# Altium project Dionysus_Camera_Expansion.PrjPCB
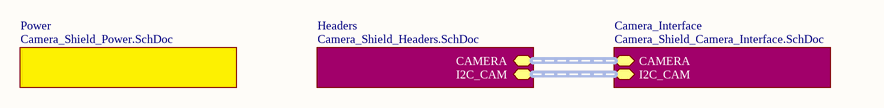
[diagram p0: Camera_Shield_Main.SchDoc]
revision: D
4 sheets, 30 parts. Net scope: hierarchical (ports join the sheet entries above them; power ports are global).
Board file: CAMERA_SHEILD_PCB.PcbDoc
Sheets:
  Camera_Shield_Main.SchDoc
    Camera_Interface = Camera_Shield_Camera_Interface.SchDoc
    Headers = Camera_Shield_Headers.SchDoc
    Power = Camera_Shield_Power.SchDoc

## Sheet Camera_Shield_Main.SchDoc: Block Diagram
size B; CompanyName: Cospan Design; DrawnBy: David McCoy; Engineer: David McCoy; Organization: Cospan Design; DocumentNumber: 1; Revision: .revision; SheetNumber: 1; SheetTotal: 4

### Sub-sheets
Camera_Interface = Camera_Shield_Camera_Interface.SchDoc: I2C_CAM (harness I2C_Harness), CAMERA (harness CAM_Harness)
Headers = Camera_Shield_Headers.SchDoc: I2C_CAM (harness I2C_Harness), CAMERA (harness CAM_Harness)
Power = Camera_Shield_Power.SchDoc: no entries

### Buses and harness runs
harness sheet Camera_Interface/CAMERA = sheet Headers/CAMERA
harness sheet Camera_Interface/I2C_CAM = sheet Headers/I2C_CAM

### Notes on the sheet
- Title:
- http://www.cospandesign.com
- Cospan Design
- Project:
- Document:
- Engineer:
- Drawn By:
- Approved By:
- Revision:
- Date:
- Number:
- of

## Sheet Camera_Shield_Camera_Interface.SchDoc: Camera Interface
size B; CompanyName: Cospan Design; DrawnBy: David McCoy; Engineer: David McCoy; Organization: Cospan Design; DocumentNumber: 3; Revision: .revision; SheetNumber: 3; SheetTotal: 4
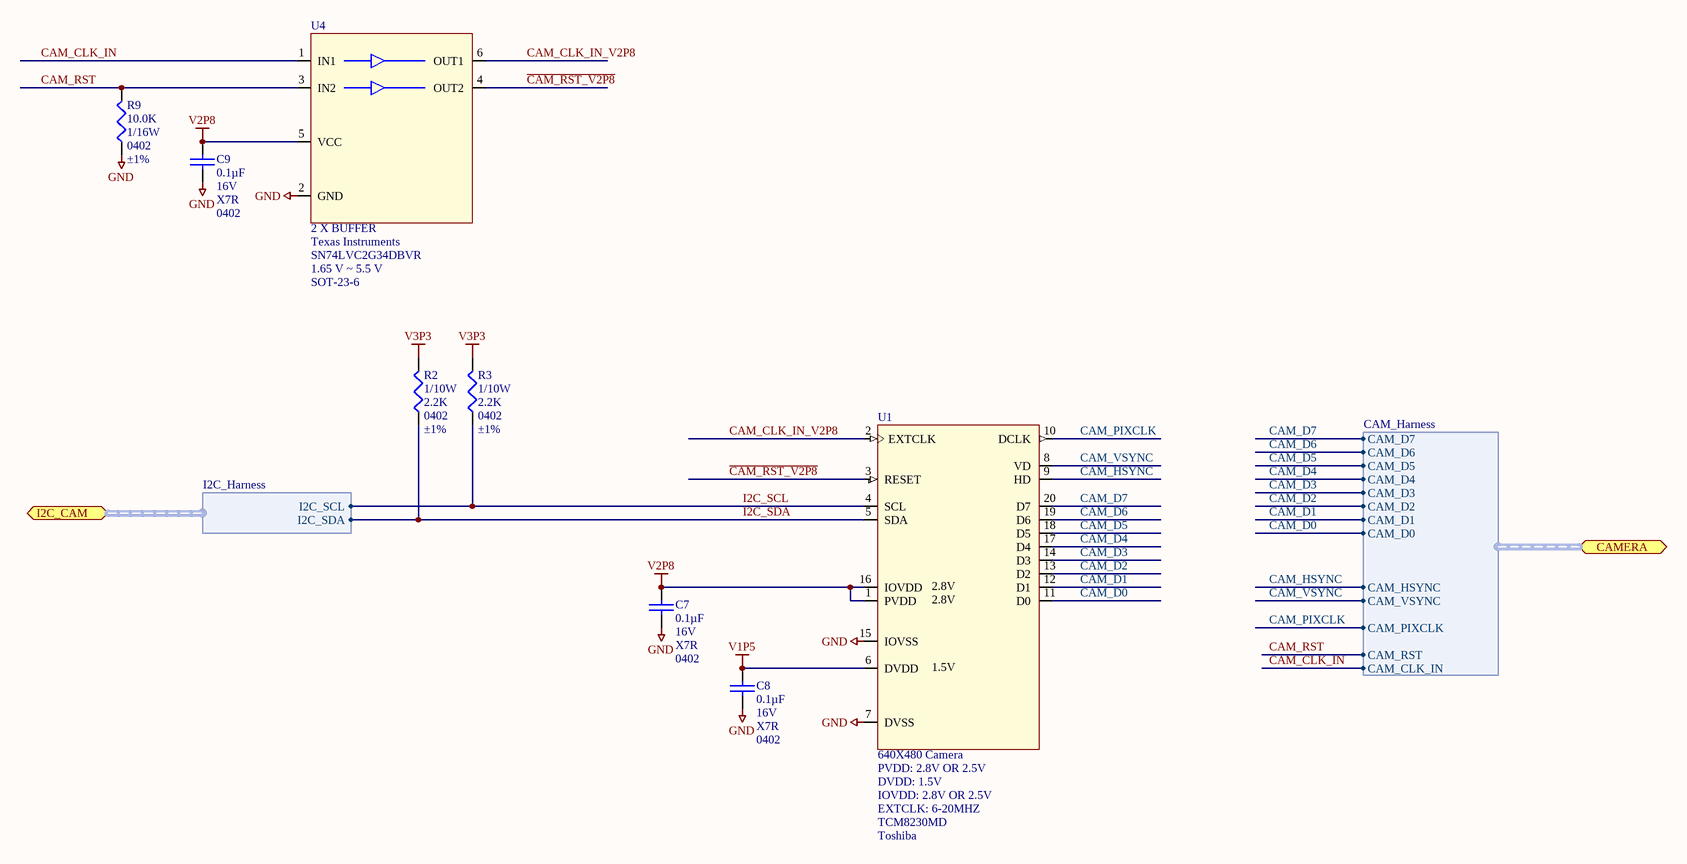
[diagram p1: Camera_Shield_Camera_Interface.SchDoc]

### Parts
C7  Capacitance: 0.1µF  Voltage - Rated: 16V  Temperature Coefficient: X7R  Package / Case: 0402  [C_0402]  (hidden comment: 0.1uF)
C8  Capacitance: 0.1µF  Voltage - Rated: 16V  Temperature Coefficient: X7R  Package / Case: 0402  [C_0402]  (hidden comment: 0.1uF)
C9  Capacitance: 0.1µF  Voltage - Rated: 16V  Temperature Coefficient: X7R  Package / Case: 0402  [C_0402]  (hidden comment: 0.1uF)
R2  Power (Watts): 1/10W  Resistance In Ohms: 2.2K  Case: 0402  Tolerance: ±1%  [ERA-0402]  (hidden comment: 2.2k Ohms)
R3  Power (Watts): 1/10W  Resistance In Ohms: 2.2K  Case: 0402  Tolerance: ±1%  [ERA-0402]  (hidden comment: 2.2k Ohms)
R9  Resistance In Ohms: 10.0K  Power (Watts): 1/16W  Case: 0402  Tolerance: ±1%  [R_0402]  (hidden comment: R_0402_10.0K)
U1  640X480 Camera  PVDD: 2.8V OR 2.5V  DVDD: 1.5V  EXTCLK: 6-20MHZ  Manufacturer: Toshiba  [TCM8230MD]
U4  2 X BUFFER  Manufacturer: Texas Instruments  Manufacturer Part Number: SN74LVC2G34DBVR  Voltage - Supply: 1.65 V ~ 5.5 V  Supplier Device Package: SOT-23-6  [SOT23-6]

### Ports
CAMERA (harness CAM_Harness), I2C_CAM (harness I2C_Harness)

### Harnesses
I2C_Harness: I2C_SDA, I2C_SCL
CAM_Harness: CAM_D7, CAM_D6, CAM_D5, CAM_D4, CAM_D3, CAM_D2, CAM_D1, CAM_D0, CAM_HSYNC, CAM_VSYNC, CAM_PIXCLK, CAM_RST, CAM_CLK_IN

### Nets
GND: C7.1 C8.1 C9.1 R9.2 U1.7(DVSS) U1.15(IOVSS) U4.2(GND)
V1P5: C8.2 U1.6(DVDD)
V2P8: C7.2 C9.2 U1.1(PVDD) U1.16(IOVDD) U4.5(VCC)
V3P3: R2.1 R3.1
~{CAM_RST_V2P8}: U1.3(RESET) U4.4(OUT2)
CAM_CLK_IN: U4.1(IN1) ; port CAMERA.CAM_CLK_IN
CAM_CLK_IN_V2P8: U1.2(EXTCLK) U4.6(OUT1)
CAM_D0: U1.11(D0) ; port CAMERA.CAM_D0
CAM_D1: U1.12(D1) ; port CAMERA.CAM_D1
CAM_D2: U1.13(D2) ; port CAMERA.CAM_D2
CAM_D3: U1.14(D3) ; port CAMERA.CAM_D3
CAM_D4: U1.17(D4) ; port CAMERA.CAM_D4
CAM_D5: U1.18(D5) ; port CAMERA.CAM_D5
CAM_D6: U1.19(D6) ; port CAMERA.CAM_D6
CAM_D7: U1.20(D7) ; port CAMERA.CAM_D7
CAM_HSYNC: U1.9(HD) ; port CAMERA.CAM_HSYNC
CAM_PIXCLK: U1.10(DCLK) ; port CAMERA.CAM_PIXCLK
CAM_RST: R9.1 U4.3(IN2) ; port CAMERA.CAM_RST
CAM_VSYNC: U1.8(VD) ; port CAMERA.CAM_VSYNC
I2C_SCL: R3.2 U1.4(SCL) ; port I2C_CAM.I2C_SCL
I2C_SDA: R2.2 U1.5(SDA) ; port I2C_CAM.I2C_SDA

### Notes on the sheet
- Title:
- http://www.cospandesign.com
- Cospan Design
- Project:
- Document:
- Engineer:
- Drawn By:
- Approved By:
- Revision:
- Date:
- Number:
- of
- (in symbol U_TCM8230MD_CAMERA) 2.8V

### Library data of the parts
C7-C9 = C_0402_0.1UF_16V: CAP CER .10UF 16V X7R 0402; Manufacturer: TDK Corporation; Manufacturer Part Number: C1005X7R1C104K; Tolerance: ±10%; Supplier 1: Digi-Key; Supplier Part Number 1: 445-4952-1-ND; RoHS: RoHS Compliant; Category: Capacitors; Stock 1: 230800; Pricing: 10=0.024, 100=0.0143, 500=0.00826, 1000=0.00572 (USD); Mounting Type: Surface Mount, MLCC; Features: General Purpose; Lead Spacing: -; Thickness: 0.50mm; Packaging: Cut Tape (CT); ComponentLink1URL: http://www.tdk.co.jp/tefe02/e412_c.pdf; ComponentLink1Description: http://www.tdk.co.jp/tefe02/e412_c.pdf; Operating Temperature: -55°C ~ 125°C
  C9: COST_1: *; COST_100: *; COST_1000: *; MANF1: *; MANF1_PN: *; MANF2: *; MANF2_PN: *; MANF3: *; MANF3_PN: *; VENDOR1: *; VENDOR1_PN: *
R2 R3 = R_0402_2.2K: RES 2.20K OHM 1/10W 1% 0402 SMD; Manufacturer: Yageo; Manufacturer Part Number: RC0402FR-072K2L; Temperature Coefficient: ±100ppm/°C; Supplier 1: Digi-Key; Supplier Part Number 1: 311-2.20KLRCT-ND; RoHS: RoHS Compliant; Category: Resistors; Stock 1: 0; Pricing: 10=0.014, 100=0.0063, 500=0.00382, 1000=0.0027, 5000=0.00203 (USD); Resistance (Ohms): 2.2K; Composition: Thick Film; Features: -; Size / Dimension: 0.039" L x 0.020" W (1.00mm x 0.50mm); Height: 0.016" (0.40mm); Packaging: Cut Tape (CT); Package / Case: 0402 (1005 Metric); ComponentLink1URL: http://www.yageo.com/documents/recent/PYu-RC0402_51_RoHS_L_6.pdf; ComponentLink1Description: http://www.yageo.com/documents/recent/PYu-RC0402_51_RoHS_L_6.pdf; Number of Terminations: 2; Supplier 2: Digi-Key; Supplier Part Number 2: RMCF0402FT2K20CT-ND; Stock 2: 39712; ComponentLink2URL: http://www.seielect.com/Catalog/SEI-RMCF_RMCP.pdf; ComponentLink2Description: http://www.seielect.com/Catalog/SEI-RMCF_RMCP.pdf
R9 = R_0402_10.0K: RES 10.0K OHM 1/16W 1% 0402 SMD; Manufacturer: Stackpole Electronics Inc; Manufacturer Part Number: RMCF0402FT10K0; Resistance (Ohms): 10k; Temperature Coefficient: ±100ppm/°C; Supplier 1: Digi-Key; Supplier Part Number 1: RMCF0402FT10K0CT-ND; RoHS: RoHS Compliant; Category: Resistors; Stock 1: 234525; Pricing: 1=0.04, 10=0.025, 50=0.0138, 100=0.0105, 250=0.0078, 500=0.00576, 1000=0.00384, 2500=0.00324, 5000=0.0027 (USD); Composition: Thick Film; Features: -; Package / Case: 0402 (1005 Metric); Size / Dimension: 0.039" L x 0.020" W (1.00mm x 0.50mm); Height: 0.016" (0.40mm); Number of Terminations: 2; Packaging: Cut Tape (CT); ComponentLink1URL: http://www.seielect.com/Catalog/SEI-RMCF_RMCP.pdf; ComponentLink1Description: http://www.seielect.com/Catalog/SEI-RMCF_RMCP.pdf; COST_1: *; COST_100: *; COST_1000: *; MANF1: *; MANF1_PN: *; MANF2: *; MANF2_PN: *; MANF3: *; MANF3_PN: *; VENDOR1: *; VENDOR1_PN: *
U1 = U_TCM8230MD_CAMERA: 640 x 480 SPARKFUN CAMERA; IOVDD: 2.8V OR 2.5V; Manufacturer Part Number: TCM8230MD
U4 = U_SN74LVC2G34DBVR: IC BUFFER DUAL NON-INV SOT23-6; Logic Type: Buffer/Line Driver, Non-Inverting; Number of Bits per Element: 1; Current - Output High, Low: 32mA, 32mA; Number of Elements: 2; Supplier 1: Digi-Key; Supplier Part Number 1: 296-13496-1-ND; RoHS: RoHS Compliant; Category: Integrated Circuits (ICs); Stock 1: 33942; Pricing: 1=0.59, 10=0.494, 25=0.4332, 100=0.3708, 250=0.3216, 500=0.2724, 1000=0.21 (USD); Packaging: Cut Tape (CT); Operating Temperature: -40°C ~ 85°C; Mounting Type: Surface Mount; Package / Case: SOT-23-6; ComponentLink1URL: http://www.ti.com/lit/ds/symlink/sn74lvc2g34.pdf; ComponentLink1Description: http://www.ti.com/lit/ds/symlink/sn74lvc2g34.pdf

## Sheet Camera_Shield_Headers.SchDoc: Shield Headers
size B; CompanyName: Cospan Design; DrawnBy: David McCoy; Engineer: David McCoy; Organization: Cospan Design; DocumentNumber: 2; Revision: .revision; SheetNumber: 2; SheetTotal: 4
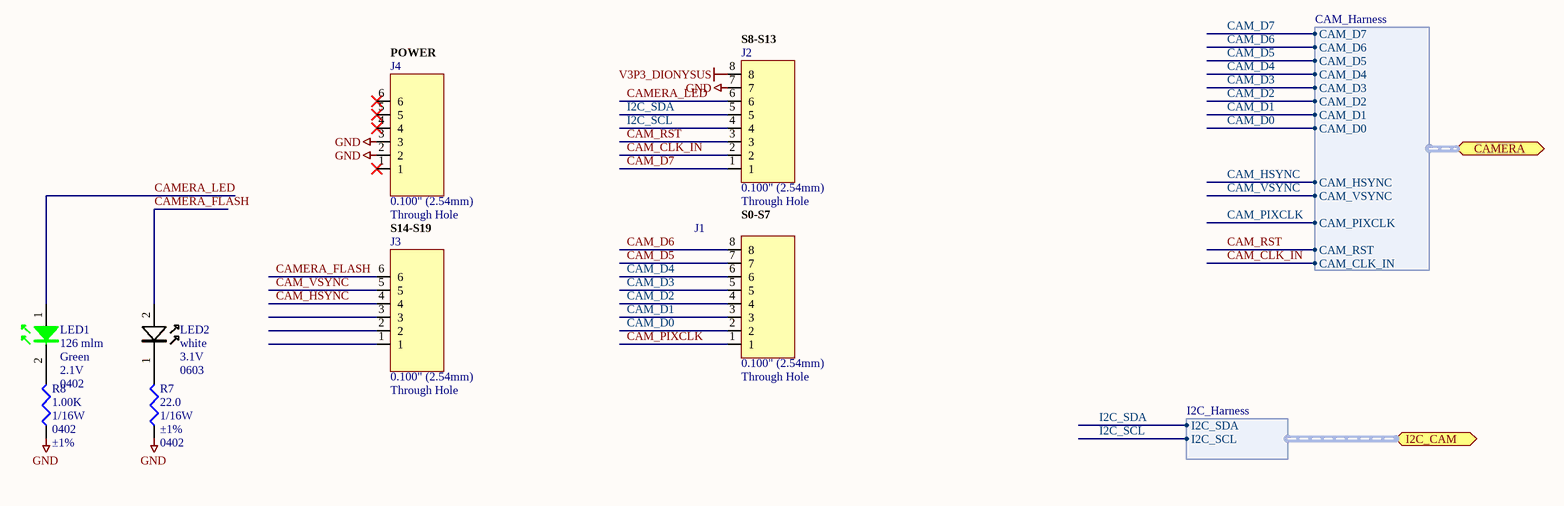
[diagram p2: Camera_Shield_Headers.SchDoc]

### Parts
J1  Pitch: 0.100" (2.54mm)  Mounting Type: Through Hole  [HDR_1X8]  (hidden comment: J_HDR1X8_THRHOLE_VERT)
J2  Pitch: 0.100" (2.54mm)  Mounting Type: Through Hole  [HDR_1X8]  (hidden comment: J_HDR1X8_THRHOLE_VERT)
J3  Pitch: 0.100" (2.54mm)  Mounting Type: Through Hole  [HDR_1X6]  (hidden comment: J_HDR1X6_THRHOLE_VERT)
J4  Pitch: 0.100" (2.54mm)  Mounting Type: Through Hole  [HDR_1X6]  (hidden comment: J_HDR1X6_THRHOLE_VERT)
LED1  Luminous Flux @ Current - Test: 126 mlm  Color: Green  Voltage - Forward (Vf) Typ: 2.1V  Package / Case: 0402  [DIOM1005X07L_GREEN]  (hidden comment: LED_GRN_0402)
LED2  Color: white  Voltage - Forward (Vf) Typ: 3.1V  Package / Case: 0603  [DIOM0603]  (hidden comment: LED_WHITE_0603)
R7  Resistance In Ohms: 22.0  Power (Watts): 1/16W  Tolerance: ±1%  Case: 0402  [ERA-0402]  (hidden comment: R_0402_22.0)
R8  Resistance In Ohms: 1.00K  Power (Watts): 1/16W  Case: 0402  Tolerance: ±1%  [ERA-0402]  (hidden comment: 1.0k Ohms)

### Ports
CAMERA (harness CAM_Harness), I2C_CAM (harness I2C_Harness)

### Harnesses
I2C_Harness: I2C_SDA, I2C_SCL
CAM_Harness: CAM_D7, CAM_D6, CAM_D5, CAM_D4, CAM_D3, CAM_D2, CAM_D1, CAM_D0, CAM_HSYNC, CAM_VSYNC, CAM_PIXCLK, CAM_RST, CAM_CLK_IN

### Nets
GND: J2.7 J4.2 J4.3 R7.2 R8.2
V3P3_DIONYSUS: J2.8
CAM_CLK_IN: J2.2 ; port CAMERA.CAM_CLK_IN
CAM_D0: J1.2 ; port CAMERA.CAM_D0
CAM_D1: J1.3 ; port CAMERA.CAM_D1
CAM_D2: J1.4 ; port CAMERA.CAM_D2
CAM_D3: J1.5 ; port CAMERA.CAM_D3
CAM_D4: J1.6 ; port CAMERA.CAM_D4
CAM_D5: J1.7 ; port CAMERA.CAM_D5
CAM_D6: J1.8 ; port CAMERA.CAM_D6
CAM_D7: J2.1 ; port CAMERA.CAM_D7
CAM_HSYNC: J3.4 ; port CAMERA.CAM_HSYNC
CAM_PIXCLK: J1.1 ; port CAMERA.CAM_PIXCLK
CAM_RST: J2.3 ; port CAMERA.CAM_RST
CAM_VSYNC: J3.5 ; port CAMERA.CAM_VSYNC
CAMERA_FLASH: J3.6 LED2.2
CAMERA_LED: J2.6 LED1.1
I2C_SCL: J2.4 ; port I2C_CAM.I2C_SCL
I2C_SDA: J2.5 ; port I2C_CAM.I2C_SDA
NetLED1_2: LED1.2 R8.1
NetLED2_1: LED2.1 R7.1

Not connected (* = marked no-connect by the designer): J3 1 2 3; J4 1* 4* 5* 6*

### Notes on the sheet
- (near J2) S8-S13
- (near J4) POWER
- S14-S19
- S0-S7
- Title:
- http://www.cospandesign.com
- Cospan Design
- Project:
- Document:
- Engineer:
- Drawn By:
- Approved By:
- Revision:
- Date:
- Number:
- of

### Library data of the parts
J1 J2 = J_HDR1X8_THRHOLE_VERT: CONN HEADER .100" 12POS TIN PCB; Manufacturer: Samtec; Manufacturer Part Number: TS-108-T-A; Connector Type: Unshrouded; Number of Positions: 8; Number of Positions Loaded: All; Supplier 1: Samtec Inc; Supplier Part Number 1: TS-108-T-A; RoHS: RoHS Compliant; Category: Connectors, Interconnects; Stock 1: 764; Number of Rows: 1; Row Spacing: -; Height Stacking (Mating): -; Height Above Board: 0.100" (2.54mm); Contact Mating Length: 0.166" (4.22mm); Termination: Solder; Contact Finish: Tin; Contact Finish Thickness: 200µin (5.08µm); Features: -; Color: Black; Packaging: Bulk; ComponentLink1URL: http://www.samtec.com/ftppub/cpdf/TX-MKT1.PDF; ComponentLink1Description: http://www.samtec.com/ftppub/cpdf/TX-MKT1.PDF
J3 J4 = J_HDR1X6_THRHOLE_VERT: CONN HEADER .100" 12POS TIN PCB; Manufacturer: Samtec; Manufacturer Part Number: TSW-106-07-T-S; Connector Type: Unshrouded; Number of Positions: 6; Number of Positions Loaded: All; Supplier 1: Samtec; Supplier Part Number 1: TSW-106-07-T-S; RoHS: RoHS Compliant; Category: Connectors, Interconnects; Stock 1: 0; Number of Rows: 1; Row Spacing: -; Height Stacking (Mating): -; Height Above Board: 0.100" (2.54mm); Contact Mating Length: 0.166" (4.22mm); Termination: Solder; Contact Finish: Tin; Contact Finish Thickness: 200µin (5.08µm); Features: -; Color: Black; Packaging: Bulk; ComponentLink1URL: http://www.samtec.com/ftppub/cpdf/TX-MKT1.PDF; ComponentLink1Description: http://www.samtec.com/ftppub/cpdf/TX-MKT1.PDF; Molding Height Above Board: 0.100" (2.54mm); ComponentLink2URL: http://www.samtec.com/ftppub/pdf/TD.PDF; ComponentLink2Description: http://www.samtec.com/ftppub/pdf/TD.PDF
LED1 = LED_GRN_0402: LED 1X0.5MM 570NM GN WTR CLR SMD; Manufacturer: Kingbright Corp; Manufacturer Part Number: APHHS1005CGCK; Current - Test: 20mA; Wavelength - Peak: 574nm; Millicandela Rating: 40mcd; Lens Type: Clear; Lens Style/Size: Rectangle, 0.8mm x 0.5mm; Viewing Angle: 120°; Supplier 1: Digi-Key; Supplier Part Number 1: 754-1101-1-ND; RoHS: RoHS Compliant; Category: Optoelectronics; Stock 1: 3400; Pricing: 1=0.24, 10=0.176, 25=0.1412, 100=0.1293, 250=0.11752, 500=0.10576, 1000=0.094 (USD); Wavelength - Dominant: 570nm; Mounting Type: Surface Mount; Packaging: Cut Tape (CT); Size / Dimension: *; Height: *; ComponentLink1URL: http://www.us.kingbright.com/images/catalog/SPEC/APHHS1005CGCK.pdf; ComponentLink1Description: http://www.us.kingbright.com/images/catalog/SPEC/APHHS1005CGCK.pdf
LED2 = LED_WHITE_0603: LED SMARTLED WHITE DIFF 0603 SMD; Manufacturer: OSRAM Opto Semiconductors Inc; Manufacturer Part Number: LW L283-P2R1-3K8L-1-Z; Millicandela Rating: 98mcd; Current - Test: 10mA; Wavelength - Dominant: 6200K; Viewing Angle: 170°, 130°; Lens Type: Diffused, Tinted; Lens Style/Size: Rectangle with Flat Top, 1.3mm x 0.8mm; Luminous Flux @ Current - Test: 400 mlm; Supplier 1: Digi-Key; Supplier Part Number 1: 475-1276-1-ND; RoHS: RoHS Compliant; Category: Optoelectronics; Stock 1: 27465; Pricing: 1=0.81, 10=0.673, 100=0.5382, 250=0.47092, 500=0.43056 (USD); Wavelength - Peak: -; Size / Dimension: 1.70mm L x 0.80mm W; Height: 0.65mm; Mounting Type: Surface Mount; Packaging: Cut Tape (CT); ComponentLink1URL: http://catalog.osram-os.com/catalogue/catalogue.do;jsessionid=AF97B8B46DD4D119AC14D4A83EF7134D?act=downloadFile&favOid=020000010003e856000100b6; ComponentLink1Description: http://catalog.osram-os.com/catalogue/catalogue.do;jsessionid=AF97B8B46DD4D119AC14D4A83EF7134D?act=downloadFile&favOid=020000010003e856000100b6
R7 = R_0402_22.0: RES 22.0 OHM 1/16W 1% 0402 SMD; Manufacturer: Vishay Dale; Manufacturer Part Number: CRCW040222R0FKED; Temperature Coefficient: ±100ppm/°C; Resistance (Ohms): 22; Supplier 1: Digi-Key; RoHS: RoHS Compliant; Category: Resistors; Stock 1: 175399; Pricing: 10=0.083, 50=0.0444, 200=0.0255, 1000=0.0174 (USD); Composition: Thick Film; Features: -; Size / Dimension: 0.039" L x 0.020" W (1.00mm x 0.50mm); Height: 0.016" (0.40mm); Packaging: Cut Tape (CT); ComponentLink1URL: http://www.vishay.com/doc?20035; ComponentLink1Description: http://www.vishay.com/doc?20035; Supplier Part Number 1: 541-22.0LCT-ND; Package / Case: 0402 (1005 Metric); Number of Terminations: 2
R8 = R_0402_1.0K: RES 1.00K OHM 1/16W 1% 0402 SMD; Manufacturer: Yageo; Manufacturer Part Number: RC0402FR-071KL; Resistance (Ohms): 1K; Temperature Coefficient: ±100ppm/°C; Supplier 1: Digi-Key; Supplier Part Number 1: 311-1.00KLRCT-ND; RoHS: RoHS Compliant; Category: Resistors; Stock 1: 2103351; Pricing: 10=0.014, 100=0.0063, 500=0.00382, 1000=0.0027, 5000=0.00203 (USD); Composition: Thick Film; Features: -; Package / Case: 0402 (1005 Metric); Size / Dimension: 0.039" L x 0.020" W (1.00mm x 0.50mm); Height: 0.016" (0.40mm); Number of Terminations: 2; Packaging: Cut Tape (CT); ComponentLink1URL: http://www.yageo.com/documents/recent/PYu-RC0402_51_RoHS_L_6.pdf; ComponentLink1Description: http://www.yageo.com/documents/recent/PYu-RC0402_51_RoHS_L_6.pdf

## Sheet Camera_Shield_Power.SchDoc: Power
size B; CompanyName: Cospan Design; DrawnBy: David McCoy; Engineer: David McCoy; Organization: Cospan Design; DocumentNumber: 4; Revision: .revision; SheetNumber: 4; SheetTotal: 4
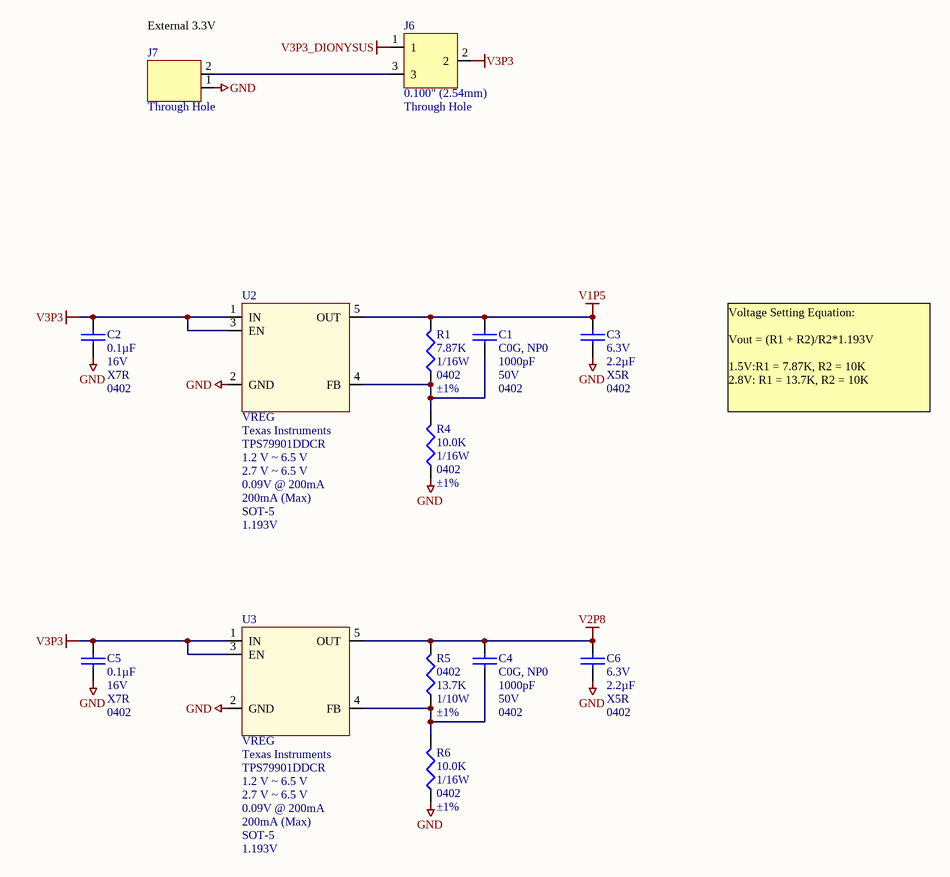
[diagram p3: Camera_Shield_Power.SchDoc]

### Parts
C1  Temperature Coefficient: C0G, NP0  Voltage - Rated: 50V  Package / Case: 0402  [C_ERA-0402]  (hidden comment: 1000pF)
C2  Capacitance: 0.1µF  Voltage - Rated: 16V  Temperature Coefficient: X7R  Package / Case: 0402  [C_0402]  (hidden comment: 0.1uF)
C3  Voltage - Rated: 6.3V  Capacitance: 2.2µF  Temperature Coefficient: X5R  Package / Case: 0402  [C_ERA-0402]  (hidden comment: 2.2uF)
C4  Temperature Coefficient: C0G, NP0  Voltage - Rated: 50V  Package / Case: 0402  [C_ERA-0402]  (hidden comment: 1000pF)
C5  Capacitance: 0.1µF  Voltage - Rated: 16V  Temperature Coefficient: X7R  Package / Case: 0402  [C_0402]  (hidden comment: 0.1uF)
C6  Voltage - Rated: 6.3V  Capacitance: 2.2µF  Temperature Coefficient: X5R  Package / Case: 0402  [C_ERA-0402]  (hidden comment: 2.2uF)
J6  Pitch: 0.100" (2.54mm)  Mounting Type: Through Hole  [HDR_1X3]  (hidden comment: J_HDR1X3_JUMPER_SELECT)
J7  Mounting Type: Through Hole  [HDR_1X2]  (hidden comment: J_HDR1X2_JUMPER)
R1  Resistance In Ohms: 7.87K  Power (Watts): 1/16W  Case: 0402  Tolerance: ±1%  [R_0402]  (hidden comment: R_0402_7.87K)
R4  Resistance In Ohms: 10.0K  Power (Watts): 1/16W  Case: 0402  Tolerance: ±1%  [ERA-0402]  (hidden comment: R_0402_10.0K)
R5  Package / Case: 0402  Resistance (Ohms): 13.7K  Power (Watts): 1/10W  Tolerance: ±1%  [ERA-0402]  (hidden comment: R_0402_13.7K)
R6  Resistance In Ohms: 10.0K  Power (Watts): 1/16W  Case: 0402  Tolerance: ±1%  [ERA-0402]  (hidden comment: R_0402_10.0K)
U2  VREG  Manufacturer: Texas Instruments  Manufacturer Part Number: TPS79901DDCR  Voltage - Output: 1.2 V ~ 6.5 V  Voltage - Input: 2.7 V ~ 6.5 V  Voltage - Dropout (Typical): 0.09V @ 200mA  Current - Output: 200mA (Max)  Supplier Device Package: SOT-5  VREF: 1.193V  [SOT95P280X90-5N]
U3  VREG  Manufacturer: Texas Instruments  Manufacturer Part Number: TPS79901DDCR  Voltage - Output: 1.2 V ~ 6.5 V  Voltage - Input: 2.7 V ~ 6.5 V  Voltage - Dropout (Typical): 0.09V @ 200mA  Current - Output: 200mA (Max)  Supplier Device Package: SOT-5  VREF: 1.193V  [SOT95P280X90-5N]

### Nets
GND: C2.1 C3.1 C5.1 C6.1 J7.1 R4.2 R6.2 U2.2(GND) U3.2(GND)
V1P5: C1.2 C3.2 R1.1 U2.5(OUT)
V2P8: C4.2 C6.2 R5.1 U3.5(OUT)
V3P3: C2.2 C5.2 J6.2 U2.1(IN) U2.3(EN) U3.1(IN) U3.3(EN)
V3P3_DIONYSUS: J6.1
NetC1_1: C1.1 R1.2 R4.1 U2.4(FB)
NetC4_1: C4.1 R5.2 R6.1 U3.4(FB)
NetJ6_3: J6.3 J7.2

### Notes on the sheet
- (near J7) External 3.3V
- Voltage Setting Equation:
  Vout = (R1 + R2)/R2*1.193V
  1.5V:R1 = 7.87K, R2 = 10K
  2.8V: R1 = 13.7K, R2 = 10K
- Title:
- http://www.cospandesign.com
- Cospan Design
- Project:
- Document:
- Engineer:
- Drawn By:
- Approved By:
- Revision:
- Date:
- Number:
- of

### Library data of the parts
C1 C4 = C_0402_1000PF_50V: CAP CER 1000PF 50V C0G 0402; Manufacturer: Murata Electronics North America; Manufacturer Part Number: GRM1555C1H102JA01D; Tolerance: ±5%; Supplier 1: Digi-Key; RoHS: RoHS Compliant; Category: Capacitors; Stock 1: 1327660; Pricing 1: 10=0.073, 100=0.0429, 500=0.02476, 1000=0.01716 (USD); Mounting Type: Surface Mount, MLCC; Operating Temperature: -55°C ~ 125°C; Features: -; Applications: General Purpose; Ratings: -; Size / Dimension: 0.040" L x 0.020" W (1.00mm x 0.50mm); Lead Spacing: -; Thickness: 0.50mm; Packaging: Cut Tape (CT); Lead Style: -; ComponentLink1URL: http://search.murata.co.jp/Ceramy/image/img/PDF/ENG/GRM1555C1H102JA01.pdf; ComponentLink1Description: http://search.murata.co.jp/Ceramy/image/img/PDF/ENG/GRM1555C1H102JA01.pdf; Supplier Part Number 1: 490-3244-1-ND; Capacitance: 1000pF; COST_1: *; COST_100: *; COST_1000: *; MANF1: *; MANF1_PN: *; MANF2: *; MANF2_PN: *; MANF3: *; MANF3_PN: *; VENDOR1: *; VENDOR1_PN: *
C2 C5 = C_0402_0.1UF_16V: as C7 on sheet Camera_Shield_Camera_Interface; Supplier 1: Digi-Key; Supplier Part Number 1: 445-4952-1-ND; RoHS: RoHS Compliant; Category: Capacitors; Stock 1: 230800; Pricing: 10=0.024, 100=0.0143, 500=0.00826, 1000=0.00572 (USD); Mounting Type: Surface Mount, MLCC; Features: General Purpose; Lead Spacing: -; Thickness: 0.50mm; Packaging: Cut Tape (CT); ComponentLink1URL: http://www.tdk.co.jp/tefe02/e412_c.pdf; ComponentLink1Description: http://www.tdk.co.jp/tefe02/e412_c.pdf; Operating Temperature: -55°C ~ 125°C
C3 C6 = C_0402_2.2UF: CAP CER 2.2UF 6.3V X5R 0402; Manufacturer: TDK Corporation; Manufacturer Part Number: C1005X5R0J225M; Tolerance: ±20%; Supplier 1: Digi-Key; Supplier Part Number 1: 445-4999-1-ND; RoHS: RoHS Compliant; Category: Capacitors; Stock 1: 511888; Pricing: 1=0.44, 10=0.33, 100=0.154, 250=0.11, 500=0.0748, 1000=0.0605 (USD); Mounting Type: Surface Mount, MLCC; Operating Temperature: -55°C ~ 85°C; Applications: General Purpose; Ratings: -; Size / Dimension: 0.039" L x 0.020" W (1.00mm x 0.50mm); Height: -; Thickness: 0.022" (0.55mm); Lead Spacing: -; Features: -; Packaging: Cut Tape (CT); Lead Style: -; ComponentLink1URL: http://www.tdk.co.jp/tefe02/e412_c.pdf; ComponentLink1Description: http://www.tdk.co.jp/tefe02/e412_c.pdf; COST_1: *; COST_100: *; COST_1000: *; MANF1: *; MANF1_PN: *; MANF2: *; MANF2_PN: *; MANF3: *; MANF3_PN: *; VENDOR1: *; VENDOR1_PN: *
J6 = J_HDR1X3_JUMPER_SELECT: CONN HEADER .100" 3POS TIN PCB; Manufacturer: Samtec; Manufacturer Part Number: TSW-103-07-T-S; Connector Type: Unshrouded; Number of Positions: 3; Number of Positions Loaded: All; Supplier 1: Samtec; Supplier Part Number 1: TSW-103-07-T-S; Category: Connectors, Interconnects; Number of Rows: 1; Height Stacking (Mating): -; Height Above Board: 0.100" (2.54mm); Contact Mating Length: 0.166" (4.22mm); Contact Finish: Tin; Contact Finish Thickness: 200µin (5.08µm); Features: -; Color: Black; ComponentLink1URL: http://www.samtec.com/ftppub/cpdf/TX-MKT1.PDF; ComponentLink1Description: http://www.samtec.com/ftppub/cpdf/TX-MKT1.PDF; Pricing: 1=0.101
J7 = J_HDR1X2_JUMPER: CONN HEADER .100" 2POS TIN PCB; Manufacturer: Samtec; Manufacturer Part Number: TSW-102-07-T-S; Number of Positions: 2; Connector Type: Unshrouded; Number of Positions Loaded: All; Pitch: 0.100" (2.54mm); NOTE: This is a 1X12 header; Category: Connectors, Interconnects; Number of Rows: 1; Supplier 1: Samtec; Supplier Part Number 1: TSW-102-07-T-S; RoHS: RoHS Compliant; Row Spacing: -; Height Stacking (Mating): -; Molding Height Above Board: 0.100" (2.54mm); Contact Mating Length: 0.166" (4.22mm); Termination: Solder; Contact Finish: Tin; Contact Finish Thickness: 200µin (5.08µm); Features: -; Color: Black; ComponentLink1URL: http://www.samtec.com/ftppub/pdf/TD.PDF; ComponentLink1Description: http://www.samtec.com/ftppub/pdf/TD.PDF
R1 = R_0402_7.87K: RES 7.87K OHM 1/16W 1% 0402 SMD; Manufacturer: Yageo; Manufacturer Part Number: RC0402FR-077K87L; Temperature Coefficient: ±100ppm/°C; Supplier 1: Digi-Key; Supplier Part Number 1: 311-7.87KLRCT-ND; RoHS: RoHS Compliant; Category: Resistors; Stock 1: 36940; Pricing: 10=0.014, 50=0.0104, 100=0.0079, 250=0.00584, 500=0.00432, 1000=0.00288 (USD); Resistance (Ohms): 7.87K; Composition: Thick Film; Features: -; Size / Dimension: 0.039" L x 0.020" W (1.00mm x 0.50mm); Height: 0.016" (0.40mm); Number of Terminations: 2; Packaging: Cut Tape (CT); Package / Case: 0402 (1005 Metric); ComponentLink1URL: http://www.yageo.com/documents/recent/PYu-RC0402_51_RoHS_L_6.pdf; ComponentLink1Description: http://www.yageo.com/documents/recent/PYu-RC0402_51_RoHS_L_6.pdf; COST_1: *; COST_100: *; COST_1000: *; MANF1: *; MANF1_PN: *; MANF2: *; MANF2_PN: *; MANF3: *; MANF3_PN: *; VENDOR1: *; VENDOR1_PN: *
R4 R6 = R_0402_10.0K: as R9 on sheet Camera_Shield_Camera_Interface; Supplier 1: Digi-Key; Supplier Part Number 1: RMCF0402FT10K0CT-ND; RoHS: RoHS Compliant; Category: Resistors; Stock 1: 234525; Pricing: 1=0.04, 10=0.025, 50=0.0138, 100=0.0105, 250=0.0078, 500=0.00576, 1000=0.00384, 2500=0.00324, 5000=0.0027 (USD); Composition: Thick Film; Features: -; Package / Case: 0402 (1005 Metric); Size / Dimension: 0.039" L x 0.020" W (1.00mm x 0.50mm); Height: 0.016" (0.40mm); Number of Terminations: 2; Packaging: Cut Tape (CT); ComponentLink1URL: http://www.seielect.com/Catalog/SEI-RMCF_RMCP.pdf; ComponentLink1Description: http://www.seielect.com/Catalog/SEI-RMCF_RMCP.pdf
R5 = R_0402_13.7K: RES 13.7K OHM 1/10W 1% 0402 SMD; Manufacturer: Panasonic - ECG; Manufacturer Part Number: ERJ-2RKF1372X; Temperature Coefficient: ±100ppm/°C; Supplier 1: Digi-Key; Supplier Part Number 1: P13.7KLCT-ND; RoHS: RoHS Compliant; Category: Resistors; Stock 1: 187486; Pricing: 1=0.06, 50=0.0242, 100=0.0184, 250=0.01364, 500=0.01008, 1000=0.00672, 5000=0.00473 (USD); Composition: Thick Film; Features: -; Size / Dimension: 0.039" L x 0.020" W (1.00mm x 0.50mm); Height: 0.016" (0.40mm); Number of Terminations: 2; Packaging: Cut Tape (CT); ComponentLink1URL: http://industrial.panasonic.com/www-cgi/jvcr13pz.cgi?E+PZ+3+AOA0002+ERJ2RKF1372X+7+WW; ComponentLink1Description: http://industrial.panasonic.com/www-cgi/jvcr13pz.cgi?E+PZ+3+AOA0002+ERJ2RKF1372X+7+WW
U2 U3 = U_TPS79901DDCR: IC REG LDO ADJ .2A TSOT-23-5; Regulator Topology: Positive Adjustable; Number of Regulators: 1; Current - Limit (Min): 200mA; Supplier 1: Digi-Key; Supplier Part Number 1: 296-17776-1-ND; RoHS: RoHS Compliant; Category: Integrated Circuits (ICs); Stock 1: 8553; Pricing: 1=0.96, 10=0.849, 25=0.766, 100=0.6703, 250=0.58788, 500=0.52136, 1000=0.4123 (USD); Operating Temperature: -40°C ~ 125°C; Mounting Type: Surface Mount; Package / Case: SOT-23-5 Thin, TSOT-23-5; Packaging: Cut Tape (CT); ComponentLink1URL: http://www.ti.com/lit/ds/symlink/tps79913.pdf; ComponentLink1Description: http://www.ti.com/lit/ds/symlink/tps79913.pdf

## Nets that join several sheets
GND: Camera_Shield_Camera_Interface (7 pins), Camera_Shield_Headers (5 pins), Camera_Shield_Power (9 pins)
V1P5: Camera_Shield_Camera_Interface (C8.2 U1.6), Camera_Shield_Power (C1.2 C3.2 R1.1 U2.5)
V2P8: Camera_Shield_Camera_Interface (5 pins), Camera_Shield_Power (C4.2 C6.2 R5.1 U3.5)
V3P3: Camera_Shield_Camera_Interface (R2.1 R3.1), Camera_Shield_Power (7 pins)
V3P3_DIONYSUS: Camera_Shield_Headers (J2.8), Camera_Shield_Power (J6.1)
CAM_CLK_IN: Camera_Shield_Camera_Interface (U4.1), Camera_Shield_Headers (J2.2)
CAM_D0: Camera_Shield_Camera_Interface (U1.11), Camera_Shield_Headers (J1.2)
CAM_D1: Camera_Shield_Camera_Interface (U1.12), Camera_Shield_Headers (J1.3)
CAM_D2: Camera_Shield_Camera_Interface (U1.13), Camera_Shield_Headers (J1.4)
CAM_D3: Camera_Shield_Camera_Interface (U1.14), Camera_Shield_Headers (J1.5)
CAM_D4: Camera_Shield_Camera_Interface (U1.17), Camera_Shield_Headers (J1.6)
CAM_D5: Camera_Shield_Camera_Interface (U1.18), Camera_Shield_Headers (J1.7)
CAM_D6: Camera_Shield_Camera_Interface (U1.19), Camera_Shield_Headers (J1.8)
CAM_D7: Camera_Shield_Camera_Interface (U1.20), Camera_Shield_Headers (J2.1)
CAM_HSYNC: Camera_Shield_Camera_Interface (U1.9), Camera_Shield_Headers (J3.4)
CAM_PIXCLK: Camera_Shield_Camera_Interface (U1.10), Camera_Shield_Headers (J1.1)
CAM_RST: Camera_Shield_Camera_Interface (R9.1 U4.3), Camera_Shield_Headers (J2.3)
CAM_VSYNC: Camera_Shield_Camera_Interface (U1.8), Camera_Shield_Headers (J3.5)
I2C_SCL: Camera_Shield_Camera_Interface (R3.2 U1.4), Camera_Shield_Headers (J2.4)
I2C_SDA: Camera_Shield_Camera_Interface (R2.2 U1.5), Camera_Shield_Headers (J2.5)